# EAGLE schematic WemosD1_MOIST (EAGLE 9.5.0)
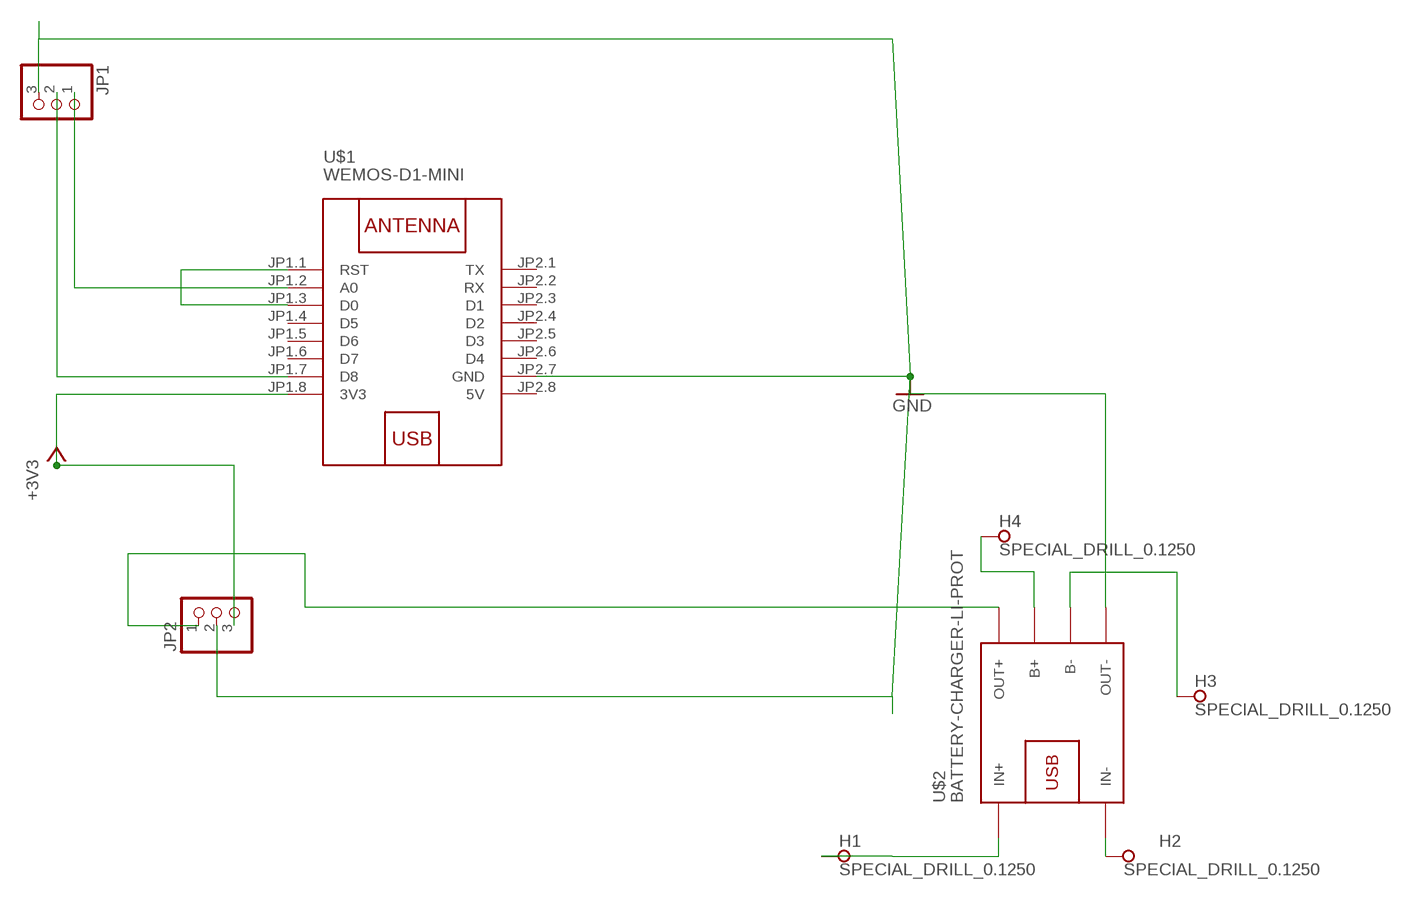
[diagram p0: schematic, sheet 1]

## Parts
H1  SPECIAL_DRILL_0.1250  [PAD_0.1250]
H2  SPECIAL_DRILL_0.1250  [PAD_0.1250]
H3  SPECIAL_DRILL_0.1250  [PAD_0.1250]
H4  SPECIAL_DRILL_0.1250  [PAD_0.1250]
JP1  PINHD-1X3/90  [1X03/90]
JP2  PINHD-1X3/90  [1X03/90]
U$1  WEMOS-D1-MINI  [WEMOS-D1-MINI]
U$2  BATTERY-CHARGER-LI-PROT  [BATTERY-CHARGER-LI-PROT]

## Nets
+3V3: JP2.3 U$1.JP1.8(3V3)
GND: JP1.3 JP2.2 U$1.JP2.7(GND) U$2.OUT-
N$1: U$1.JP1.1(RST) U$1.JP1.3(D0)
N$2: H3.1 U$2.B-
N$3: H4.1 U$2.B+
N$5: JP1.2 U$1.JP1.7(D8)
N$6: JP1.1 U$1.JP1.2(A0)
N$7: JP2.1 U$2.OUT+
N$8: H2.1 U$2.IN-
N$9: H1.1 U$2.IN+
Unconnected: U$1.JP1.4(D5) U$1.JP1.5(D6) U$1.JP1.6(D7) U$1.JP2.1(TX) U$1.JP2.2(RX) U$1.JP2.3(D1) U$1.JP2.4(D2) U$1.JP2.5(D3) U$1.JP2.6(D4)

## Power pins joined to a net without a drawn wire
5V: U$1.JP2.8(5V)

## Library data of the parts
H1-H4 = special-drill:SPECIAL_DRILL_: Special drills
JP1 JP2 = pinhead:PINHD-1X3: PIN HEADER
U$1 = diy-modules:WEMOS-D1-MINI: WEMOS D1 mini: Mini Wi-Fi Board based on ESP-8266 device More details can be found here: https://www.wemos.cc/product/d1-mini.html Click here to find device on ebay.com <http://www.ebay.com/sch/wemos+d1+mini+nodemcu>
U$2 = diy-modules:BATTERY-CHARGER-LI-PROT: Lithium Battery 5V Charger with protection circuit More details available here: http://www.instructables.com/id/DIY-Lithium-ion-Battery-Charger/step4/TP4056-based-lithium-ion-battery-charger-module/ Click here to find device on ebay.com <http://www.ebay.com/sch/tp4056+charger+usb+protection>